# EasyEDA Pro project F405飞控板_2025-11-19.epro

# Schematic F405飞控原理图
Board Name: 飞控板; Create Date: 2024-11-21; Page Name: P1; Project Name: F405空心杯飞控; Schematic Name: F405飞控原理图; Update Date: 2025-05-13; Company: 嘉立创EDA; Page Size: A4; Version: V1.0
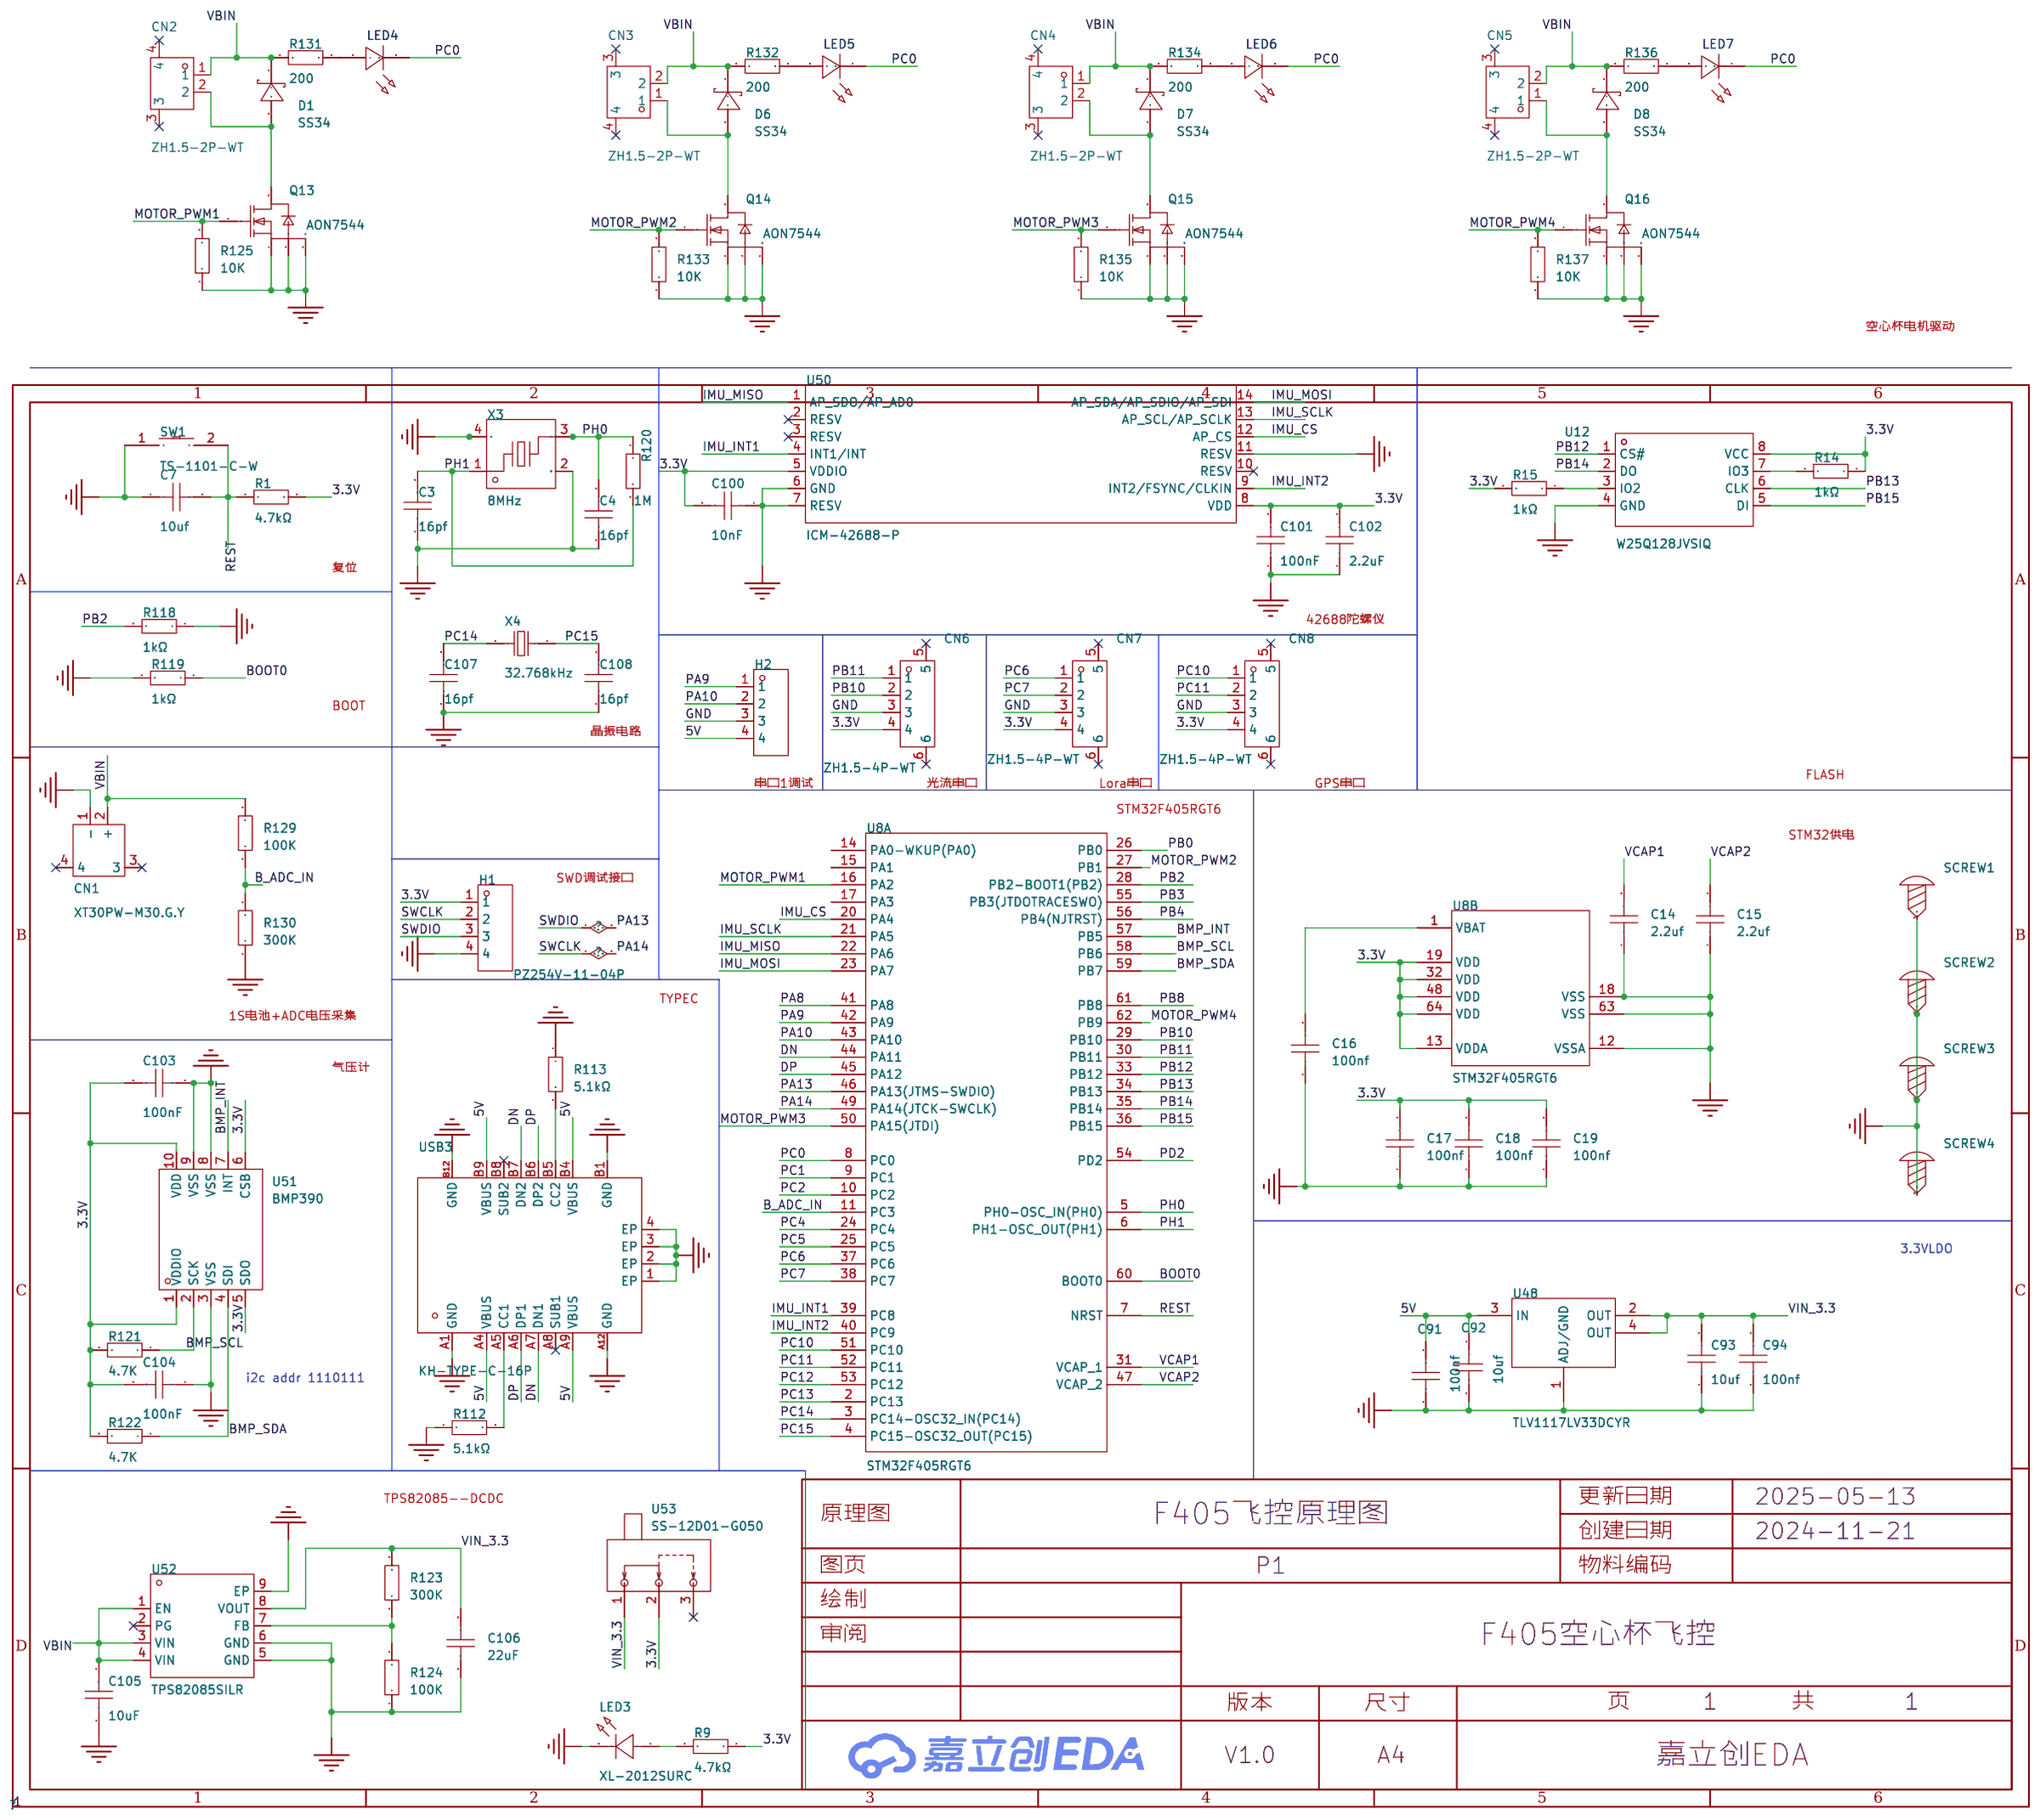
[diagram p0: schematic sheet]

## Parts
C3  16pf  [C0805]
C4  16pf  [C0805]
C7  10uf  [C0805]
C14  2.2uf  [C0603]
C15  2.2uf  [C0603]
C16  100nf  [C0603]
C17  100nf  [C0603]
C18  100nf  [C0603]
C19  100nf  [C0603]
C91  100nf  [C0603]
C92  10uf  [C0805]
C93  10uf  [C0805]
C94  100nf  [C0603]
C100  10nF  [C0603]
C101  100nF  [C0603]
C102  2.2uF  [C0603]
C103  100nF  [C0603]
C104  100nF  [C0603]
C105  10uF  [C0805]
C106  22uF  [C0805]
C107  16pf  [C0805]
C108  16pf  [C0805]
CN1  XT30PW-M30.G.Y  [CONN-TH_XT30PW-M]
CN2  ZH1.5-2P-WT  [CONN-SMD_ZH1.5-2P-WT]
CN3  ZH1.5-2P-WT  [CONN-SMD_ZH1.5-2P-WT]
CN4  ZH1.5-2P-WT  [CONN-SMD_ZH1.5-2P-WT]
CN5  ZH1.5-2P-WT  [CONN-SMD_ZH1.5-2P-WT]
CN6  ZH1.5-4P-WT  [CONN-TH_ZH1.5-4P-WT]
CN7  ZH1.5-4P-WT  [CONN-TH_ZH1.5-4P-WT]
CN8  ZH1.5-4P-WT  [CONN-TH_ZH1.5-4P-WT]
D1  SS34  [SMA_L4.3-W2.6-LS5.2-RD]
D6  SS34  [SMA_L4.3-W2.6-LS5.2-RD]
D7  SS34  [SMA_L4.3-W2.6-LS5.2-RD]
D8  SS34  [SMA_L4.3-W2.6-LS5.2-RD]
H1  PZ254V-11-04P  [HDR-TH_4P-P2.54-V-M]
H2  -  [HDR-TH_4P-P2.54-V-F]
LED3  XL-2012SURC  [LED0805-R-RD]
LED4  -  [LED_0805]
LED5  -  [LED_0805]
LED6  -  [LED_0805]
LED7  -  [LED_0805]
Q13  AON7544  [DFN-8_L3.3-W3.3-P0.65-BL-2]
Q14  AON7544  [DFN-8_L3.3-W3.3-P0.65-BL-2]
Q15  AON7544  [DFN-8_L3.3-W3.3-P0.65-BL-2]
Q16  AON7544  [DFN-8_L3.3-W3.3-P0.65-BL-2]
R1  4.7kΩ  [R0603]
R9  4.7kΩ  [R0603]
R14  1kΩ  [R0603]
R15  1kΩ  [R0603]
R112  5.1kΩ  [R0603]
R113  5.1kΩ  [R0603]
R118  1kΩ  [R0603]
R119  1kΩ  [R0603]
R120  1M  [R0603]
R121  4.7K  [R0603]
R122  4.7K  [R0603]
R123  300K  [R0603]
R124  100K  [R0603]
R125  10K  [R0603]
R129  100K  [R0603]
R130  300K  [R0603]
R131  200  [R0603]
R132  200  [R0603]
R133  10K  [R0603]
R134  200  [R0603]
R135  10K  [R0603]
R136  200  [R0603]
R137  10K  [R0603]
SCREW1  -  [M2螺丝]
SCREW2  -  [M2螺丝]
SCREW3  -  [M2螺丝]
SCREW4  -  [M2螺丝]
SW1  TS-1101-C-W  [SW-SMD_L6.0-W3.3-LS8.0]
U8  STM32F405RGT6  [LQFP-64_L10.0-W10.0-P0.50-LS12.0-BL]  (sections 1,2)
U12  W25Q128JVSIQ  [SOIC-8_L5.3-W5.3-P1.27-LS8.0-BL]
U48  TLV1117LV33DCYR  [SOT-223_L6.7-W3.5-P2.30-BR]
U50  ICM-42688-P  [LGA-14_L3.0-W2.5-P0.50-TL]
U51  BMP390  [LGA-10_L2.0-W2.0-P0.50-BL]
U52  TPS82085SILR  [USIP-8_L3.0-W2.8-P0.65-BL-EP]
U53  SS-12D01-G050  [SW-TH_SS-12D01-GX]
USB3  KH-TYPE-C-16P  [USB-C-SMD_KH-TYPE-C-16P]
X3  8MHz  [CRYSTAL-SMD_4P-L3.2-W2.5-BL]
X4  32.768kHz  [FC-135R_L3.2-W1.5]

## Library data of the parts
C3 C4 C7 C14-C19 C107 C108 = 0805CG221J201NT: LCSC Part Name: 贴片电容; Supplier Part: C20616263; Manufacturer: FH(风华); Supplier Footprint: 0805; JLCPCB Part Class: 扩展库; Datasheet: https://atta.szlcsc.com/upload/public/pdf/source/20230606/6BE0BBCA5E224779106B8DA12BAB40D1.pdf; Supplier: LCSC
C91-C94 = CL21A226MAQNNNE: 容值:22uF;精度:±20%;额定电压:25V;材质(温度系数):X5R;; LCSC Part Name: 22uF ±20% 25V; Supplier Part: C45783; Manufacturer: SAMSUNG(三星); Supplier Footprint: 0805; JLCPCB Part Class: 基础库; Datasheet: https://atta.szlcsc.com/upload/public/pdf/source/20160218/1457707763339.pdf; Supplier: LCSC; Tolerance: ±20%; Voltage Rated: 25V; Temperature Coefficient: X5R
C100-C106 = CAP_0603: Supplier Footprint: 0603
CN1 = XT30PW-M30.G.Y: 类别:-;类型1:-;; LCSC Part Name: AMASS(艾迈斯)航模插头 卧式弯脚 XT30PW-M公头; Supplier Part: C431092; Manufacturer: AMASS(艾迈斯); JLCPCB Part Class: 扩展库; Datasheet: https://atta.szlcsc.com/upload/public/pdf/source/20220222/6A9F22F7850E25B33E1BE430ADF8560B.pdf; Supplier: LCSC; Type: 航模插头; RatedVoltage: DC 500V; InterfaceType: 公头; RatedCurrent: 15A; RecommendedWireGauge: 16/18/20AWG; contact resistance: 1.2mΩ; specifications: 2pin
CN2-CN5 = ZH1.5-2P-WT: 插针结构:1x2P;间距:1.5mm;安装方式:卧贴;参考系列:ZH;总PIN数:2P;排数:1;每排PIN数:2;行距:-;额定电流:1A;工作温度范围:-25℃~+85℃;; LCSC Part Name: 1x2P 间距:1.5mm 卧贴 系列:ZH; Supplier Part: C722913; Manufacturer: CAX(创都); Supplier Footprint: SMD,P=1.5mm,卧贴; JLCPCB Part Class: 扩展库; Datasheet: https://atta.szlcsc.com/upload/public/pdf/source/20200828/C722917_EA5F3D2C7FEC6D00EC455146A7985164.pdf; Supplier: LCSC; Pins Structure: 1x2P; Pitch: 1.5mm; Mounting Style: 卧贴; Reference Series: ZH; Number of Pins: 2P; Number of Rows: 1; Number of PINs Per Row: 2; Current Rating (Max): 1A; Operating Temperature Range: -25℃~+85℃
CN6-CN8 = ZH1.5-4P-WT: 插针结构:1x4P;间距:1.5mm;安装方式:卧贴;参考系列:ZH;总PIN数:4P;排数:1;每排PIN数:4;行距:-;额定电流:1A;工作温度范围:-25℃~+85℃;; LCSC Part Name: 1x4P 间距:1.5mm 卧贴 系列:ZH; Supplier Part: C722921; Manufacturer: CAX(创都); Supplier Footprint: SMD,P=1.5mm,卧贴; JLCPCB Part Class: 扩展库; Datasheet: https://atta.szlcsc.com/upload/public/pdf/source/20200828/C722917_EA5F3D2C7FEC6D00EC455146A7985164.pdf; Supplier: LCSC; Pins Structure: 1x4P; Pitch: 1.5mm; Mounting Style: 卧贴; Reference Series: ZH; Number of Pins: 4P; Number of Rows: 1; Number of PINs Per Row: 4; Current Rating (Max): 1A; Operating Temperature Range: -25℃~+85℃
D1 D6-D8 = SS34_C8678: 二极管配置:独立式;正向压降(Vf):550mV@3A;直流反向耐压(Vr):40V;整流电流:3A;; LCSC Part Name: 电压:40V 电流:3A; Supplier Part: C8678; Manufacturer: MDD(辰达半导体); Supplier Footprint: SMA(DO-214AC); JLCPCB Part Class: 基础库; Datasheet: https://atta.szlcsc.com/upload/public/pdf/source/20240710/2118BB86FDDB2E0B294389AC1F3F65C8.pdf; Supplier: LCSC; Diode Configuration: 独立式; Forward Voltage (Vf@If): 550mV@3A; Reverse Voltage (Vr): 40V; Rectified Current: 3A; Reverse Leakage Current (Ir): 500uA@40V
H1 = PZ254V-11-04P: 插针结构:1x4P;间距:2.54mm;行距:-;圆针/方针:方针;安装类型:直插;排数:单排;总PIN位数:4P;额定电流:3A;额定电压:250V;配合针长度:6mm;塑高:2.5mm;端接针长度:3mm;触头材质:-;工作温度范围:-40℃~+105℃;颜色:黑色;; LCSC Part Name: 间距:2.54mm 1x4P 直插 方针; Supplier Part: C2691448; Manufacturer: XFCN(兴飞); Supplier Footprint: 插件,P=2.54mm; JLCPCB Part Class: 扩展库; Datasheet: https://atta.szlcsc.com/upload/public/pdf/source/20200309/C492403_F9F19131791D08044AD4F84F8E751A34.pdf; Supplier: LCSC; Pin Structure: 1x4P; Pitch: 2.54mm; Circluar Pins/Square Pins: 方针; Mounting Type: 直插; Number of Rows: 单排; Number of Pins: 4P; Current Rating (Max): 3A; Voltage Rating (Max): 250V; Length of Mating Pin: 6mm; Insulation Height: 2.5mm; Length of End Connection Pin: 3mm; Operating Temperature Range: -40℃~+105℃; Color: 黑色
H2 = HDR-F_2.54_1x4P: Supplier Part: C2718488; Supplier Footprint: 插件
LED3 = XL-2012SURC: 发光颜色:红色;功率:55mW;正向电流:25mA;主波长:617nm~621nm;透镜颜色:无色透明透镜;色温:-;发光角度:120°;载带方式:正贴;工作温度:-30℃~+85℃;; Supplier Part: C965812; Manufacturer: XINGLIGHT(成兴光); Supplier Footprint: 0805; JLCPCB Part Class: 扩展库; Datasheet: https://atta.szlcsc.com/upload/public/pdf/source/20221102/49E1A0A365644091E6270AF1C5E0FE37.pdf; Supplier: LCSC; Emitted Color: 红色; Power Dissipation: 55mW; Forward Current: 25mA; Dominant Wavelength: 617nm~621nm; Peak Wavelength: 623nm; Lens Color: 无色透明透镜; Viewing Angle: 120°; Mounting Sytle: 正贴; Operating Temperature: -30℃~+85℃
LED4-LED7 = LED_0805-B: Supplier Footprint: 0805
Q13-Q16 = AON7544: 类型:1个N沟道;漏源电压(Vdss):30V;连续漏极电流(Id):30A;导通电阻(RDS(on)@Vgs,Id):8.5mΩ@4.5V,20A;功率(Pd):3W;阈值电压(Vgs(th)@Id):1.2V@250uA;; LCSC Part Name: 1个N沟道 耐压:30V 电流:30A; Supplier Part: C315567; Manufacturer: AOS; Supplier Footprint: DFN-8(3x3); JLCPCB Part Class: 扩展库; Datasheet: https://atta.szlcsc.com/upload/public/pdf/source/20190614/C315567_E434D67BCCEB23ABC813CC1BF26EA614.pdf; Supplier: LCSC; Type: 1个N沟道; Drain Source Voltage (Vdss): 30V; Continuous Drain Current (Id): 30A; Drain Source On Resistance (RDS(on)@Vgs,Id): 8.5mΩ@4.5V,20A; Power Dissipation (Pd): 3W; Gate Threshold Voltage (Vgs(th)@Id): 1.2V@250uA; Total Gate Charge (Qg@Vgs): 22.5nC@10V; Input Capacitance (Ciss@Vds): 951pF; Reverse Transfer Capacitance (Crss@Vds): 157pF; Operating Temperature: -55℃~+150℃
R1 R9 R14 R15 R118 R119 = 0805W8F4701T5E: 电阻类型:厚膜电阻;阻值:4.7kΩ;精度:±1%;功率:125mW;最大工作电压:150V;温度系数:±100ppm/℃;; LCSC Part Name: 4.7kΩ ±1% 125mW 厚膜电阻; Supplier Part: C17673; Manufacturer: UNI-ROYAL(厚声); Supplier Footprint: 0805; JLCPCB Part Class: 基础库; Datasheet: https://atta.szlcsc.com/upload/public/pdf/source/20200306/C422600_1E6D84923E4A46A82E41ADD87F860B5C.pdf; Supplier: LCSC; Type: 厚膜电阻; Tolerance: ±1%; Power(Watts): 125mW; Overload Voltage (Max): 150V; Temperature Coefficient: ±100ppm/℃; Operating Temperature Range: -55℃~+155℃
R112 R113 = 0805W8F1002T5E_C17414: 电阻类型:厚膜电阻;阻值:10kΩ;精度:±1%;功率:125mW;最大工作电压:150V;温度系数:±100ppm/℃;; LCSC Part Name: 10kΩ ±1% 125mW 厚膜电阻; Supplier Part: C17513; Manufacturer: UNI-ROYAL(厚声); Manufacturer Part: 0805W8F1002T5E; Supplier Footprint: 0805; JLCPCB Part Class: 基础库; Datasheet: https://atta.szlcsc.com/upload/public/pdf/source/20200306/C422600_1E6D84923E4A46A82E41ADD87F860B5C.pdf; Supplier: LCSC; Type: 厚膜电阻; Tolerance: ±1%; Power(Watts): 125mW; Overload Voltage (Max): 150V; Temperature Coefficient: ±100ppm/℃; Operating Temperature Range: -55℃~+155℃
R120-R122 R125 R129-R137 = Res_0603: Supplier Footprint: 0603
R123 R124 = Res_0805: Supplier Footprint: 0805
SCREW1-SCREW4 = M2螺丝: Supplier Footprint: 插件
SW1 = TS-1101-C-W: 电路结构:单刀单掷;按钮形状:矩形按钮;作用力:260gf;安装方式:立贴;开关长度:6mm;开关宽度:3.6mm;开关高度:2.5mm;带支架:不带;触点电流:50mA;额定电压(AC):-;额定电压(DC):12V;额定功率:-;绝缘电阻:-;带灯:无;机械寿命:5万次;; LCSC Part Name: 6*3.6*2.5mm 立贴 轻触开关; Supplier Part: C318938; Manufacturer: XKB Connectivity(中国星坤); Supplier Footprint: SMD; JLCPCB Part Class: 扩展库; Datasheet: https://atta.szlcsc.com/upload/public/pdf/source/20200227/C318938_C2E53B1EEDE37D980A33616AC086DE53.pdf; Supplier: LCSC; Circuit: 单刀单掷; Actuator Style: 矩形按钮; Operating Force: 260gf; Mounting Style: 立贴; Switch Length: 6mm; Switch Width: 3.6mm; Switch Height: 2.5mm; Strike Gundam: 不带; Contact Current: 50mA; Voltage Rating (DC): 12V; Actuator/Cap Color: 白色带淡绿; With Lamp: 无; Mechanical Life: 5万次; Operating Temperature: -30℃~+85℃
U8 = STM32F405RGT6: CPU内核:ARM-M4;程序存储容量:1MB;RAM总容量:192KB;GPIO端口数量:51;工作电压范围:1.8V~3.6V;CPU最大主频:168MHz;程序存储器类型:FLASH;; LCSC Part Name: 带DSP和FPU的高性能基础系列ARM Cortex-M4 MCU，具有1 MB Flash、168 MHz CPU和ART加速器; Supplier Part: C15742; Manufacturer: ST(意法半导体); Supplier Footprint: LQFP-64(10x10); JLCPCB Part Class: 扩展库; Datasheet: https://atta.szlcsc.com/upload/public/pdf/source/20140801/1457707197138.pdf; Supplier: LCSC; CPU Core: ARM-M4; Program Storage Size: 1MB; RAM Size: 192KB; GPIO Ports Number: 51; Operating Voltage Range: 1.8V~3.6V; CPU Maximum Speed: 168MHz; Program Memory Type: FLASH; Operating Temperature Range: -40℃~+85℃; ADC (Bit): 12bit; DAC (Bit): 12bit; Universal Serial Bus: 有; Peripheral/Function: DMA；LCD/LED驱动；PWM; Watchdog: 有; Infrared Data Association: 有; Low-Voltage Detect: 有; LCD Module: 有; Direct Memory Access: 有; Internal Oscillator: 有
U12 = W25Q128JVSIQ: 接口类型:-;存储容量:128Mbit;时钟频率(fc):-;; LCSC Part Name: W25Q128JVSIQ 编带; Supplier Part: C97521; Manufacturer: WINBOND(华邦); Supplier Footprint: SOIC-8-208mil; JLCPCB Part Class: 基础库; Datasheet: https://atta.szlcsc.com/upload/public/pdf/source/20170316/1489627409956.pdf; Supplier: LCSC; Memory Size: 128Mbit
U48 = TLV1117LV33DCYR: 输出类型:固定;最大输入电压:5.5V;输出电压:3.3V;输出电流:1A;电源纹波抑制比(PSRR):75dB@(120Hz);输出极性:正极;; LCSC Part Name: 1A 低压降稳压器; Supplier Part: C15578; Manufacturer: TI(德州仪器); Supplier Footprint: SOT-223; JLCPCB Part Class: 扩展库; Datasheet: https://www.ti.com/cn/lit/gpn/tlv1117lv; Supplier: LCSC; Output Type: 固定; Maximum Input Voltage: 5.5V; Output Voltage: 3.3V; Output Current: 1A; Power Supply Rejection Ratio (PSRR): 75dB@(120Hz); Dropout Voltage: 1.3V@(800mA); standby current: 100uA; Feature: 防静电保护；低ESR；热保护(TSD)；欠压闭锁；过流保护(OCP)；带使能; Operating Temperature: -40℃~+125℃; Output Polarity: 正极; Number of Outputs: 1
U50 = ICM-42688-P: 传感器类型:加速度计陀螺仪;; Supplier Part: C1850418; Manufacturer: TDK InvenSense(应美盛); Supplier Footprint: LGA-14(2.5x3); JLCPCB Part Class: 扩展库; Datasheet: https://atta.szlcsc.com/upload/public/pdf/source/20210703/CF24204867ACE5B754A2B035F23E5931.pdf; Supplier: LCSC; Sensor Type: 加速度计陀螺仪
U51 = BMP390_C5124834: 压力范围:30Kpa~125Kpa;; Supplier Part: C5124834; Manufacturer: Bosch(博世); Supplier Footprint: LGA-10(2x2); JLCPCB Part Class: 扩展库; Datasheet: https://atta.szlcsc.com/upload/public/pdf/source/20221222/1C81EE3357D96DEF74970C4DA2251172.pdf; Supplier: LCSC; Pressure range: 30Kpa~125Kpa; The Power Supply Voltage: 1.65V~3.6V; Operating Temperature: -40℃~+85℃
U52 = TPS82085SILR: TPS82085 集成感应器的 3A 降压转换器（截面 &lt; 1.3mm）; Supplier Part: C465728; Manufacturer: TI(德州仪器); Supplier Footprint: USIP-8; JLCPCB Part Class: 扩展库; Datasheet: https://www.ti.com/cn/lit/gpn/tps82085; Supplier: LCSC
U53 = SS-12D01-G050: 1P2T直柄拨动开关；柄长5.0mm；行程2.0mm；单排两档拨动; LCSC Part Name: 拨动开关SS-12D01 柄高5mm; Supplier Part: C5446805; Manufacturer: G-Switch(品赞); Supplier Footprint: 插件; JLCPCB Part Class: 扩展库; Datasheet: https://atta.szlcsc.com/upload/public/pdf/source/20230412/820259B1122C3B165ABC23F7C0C2BED1.pdf; Supplier: LCSC
USB3 = KH-TYPE-C-16P: 连接器类型:Type-C;标准:-;公母:母;端口数量:1;触点数量:16P;安装方式:卧贴;额定电流 - 电源:3A;工作温度范围:-40℃~+85℃;; LCSC Part Name: Type-C 母 卧贴; Supplier Part: C709357; Manufacturer: kinghelm(金航标); Supplier Footprint: SMD; JLCPCB Part Class: 扩展库; Datasheet: https://atta.szlcsc.com/upload/public/pdf/source/20200911/C709357_AA8DCEB38BB20E3035A7ED7AE7667837.pdf; Supplier: LCSC; Connector Type: Type-C; Gender: 母; Number of Ports: 1; Number of Contacts: 16P; Mounting Style: 卧贴; Current Rating - Power (Max): 3A; Operating Temperature Range: -40℃~+85℃
X3 = X32258MSB4SI: 晶振类型:贴片晶振;频率:8MHz;常温频差:±10ppm;外接负载电容:20pF;频率稳定度(全温):±20ppm;; LCSC Part Name: 8MHz ±10ppm 20pF; Supplier Part: C2682774; Manufacturer: YXC(扬兴晶振); Supplier Footprint: SMD3225-4P; JLCPCB Part Class: 扩展库; Datasheet: https://atta.szlcsc.com/upload/public/pdf/source/20240329/19D5F850207469550BEB00D7DFEDBC7A.pdf; Supplier: LCSC; Crystal Type: 贴片晶振; Normal temperature Frequency Tolerance: ±10ppm; External load capacitor: 20pF; Frequency Stability(Full temperature range): ±20ppm; Operating Temperature: -40℃~+85℃
X4 = Q13FC13500004_C32346: 晶振类型:贴片晶振;频率:32.768kHz;常温频差:±20ppm;负载电容:12.5pF;; LCSC Part Name: 32.768kHz ±20ppm 12.5pF; Supplier Part: C32346; Manufacturer: EPSON(爱普生); Manufacturer Part: Q13FC13500004; Supplier Footprint: SMD3215-2P; JLCPCB Part Class: 基础库; Datasheet: https://atta.szlcsc.com/upload/public/pdf/source/20240418/0E0FF5F0356BA3753F616001439D1416.pdf; Supplier: LCSC; Crystal Type: 贴片晶振; Normal temperature Frequency Tolerance: ±20ppm; Load Capacitor: 12.5pF; Equivalent Series Resistance (ESR): 70kΩ; Operating Temperature: -40℃~+85℃

## Nets
3.3V: C17.2 C18.2 C19.2 C100.2 C101.2 C102.2 C103.2 C104.2 CN6.4 CN7.4 CN8.4 H1.1 R1.2 R9.1 R14.1 R15.2 R121.2 R122.2 U8.13(VDDA) U8.19(VDD) U8.32(VDD) U8.48(VDD) U8.64(VDD) U12.8(VCC) U50.5(VDDIO) U50.8(VDD) U51.1(VDDIO) U51.5(SDO) U51.6(CSB) U51.10(VDD) U53.2
5V: C91.2 C92.1 H2.4 U48.3(IN) USB3.A4(VBUS) USB3.A9(VBUS) USB3.B4(VBUS) USB3.B9(VBUS)
GND: C3.1 C4.1 C7.1 C14.1 C15.1 C16.1 C17.1 C18.1 C19.1 C91.1 C92.2 C93.1 C94.1 C100.1 C101.1 C102.1 C103.1 C104.1 C105.1 C106.1 C107.1 C108.1 CN1.1(-) CN6.3 CN7.3 CN8.3 H1.4 H2.3 LED3.2(K) Q13.1(S) Q13.2(S) Q13.3(S) Q14.1(S) Q14.2(S) Q14.3(S) Q15.1(S) Q15.2(S) Q15.3(S) Q16.1(S) Q16.2(S) Q16.3(S) R112.1 R113.1 R118.1 R119.2 R124.1 R125.1 R130.1 R133.1 R135.1 R137.1 SCREW1.1 SCREW2.1 SCREW3.1 SCREW4.1 SW1.1 U8.12(VSSA) U8.18(VSS) U8.63(VSS) U12.4(GND) U48.1(ADJ/GND) U50.6(GND) U50.7(RESV) U50.11(RESV) U51.3(VSS) U51.8(VSS) U51.9(VSS) U52.5(GND) U52.6(GND) U52.9(EP) USB3.1(EP) USB3.2(EP) USB3.3(EP) USB3.4(EP) USB3.A1(GND) USB3.A12(GND) USB3.B1(GND) USB3.B12(GND) X3.2(GND) X3.4(GND)
VIN_3.3: C93.2 C94.2 C106.2 R123.2 U48.2(OUT) U48.4(OUT) U52.8(VOUT) U53.1
B_ADC_IN: R129.1 R130.2 U8.11(PC3)
BMP_INT: U8.57(PB5) U51.7(INT)
BMP_SCL: R121.1 U8.58(PB6) U51.2(SCK)
BMP_SDA: R122.1 U8.59(PB7) U51.4(SDI)
BOOT0: R119.1 U8.60(BOOT0)
DN: U8.44(PA11) USB3.A7(DN1) USB3.B7(DN2)
DP: U8.45(PA12) USB3.A6(DP1) USB3.B6(DP2)
IMU_CS: U8.20(PA4) U50.12(AP_CS)
IMU_INT1: U8.39(PC8) U50.4(INT1/INT)
IMU_INT2: U8.40(PC9) U50.9(INT2/FSYNC/CLKIN)
IMU_MISO: U8.22(PA6) U50.1(AP_SDO/AP_AD0)
IMU_MOSI: U8.23(PA7) U50.14(AP_SDA/AP_SDIO/AP_SDI)
IMU_SCLK: U8.21(PA5) U50.13(AP_SCL/AP_SCLK)
MOTOR_PWM1: Q13.4(G) R125.2 U8.16(PA2)
MOTOR_PWM2: Q14.4(G) R133.2 U8.27(PB1)
MOTOR_PWM3: Q15.4(G) R135.2 U8.50(PA15(JTDI))
MOTOR_PWM4: Q16.4(G) R137.2 U8.62(PB9)
PA8: U8.41(PA8)
PA9: H2.1 U8.42(PA9)
PA10: H2.2 U8.43(PA10)
PA13: H1.3 U8.46(PA13(JTMS-SWDIO))
PA14: H1.2 U8.49(PA14(JTCK-SWCLK))
PB0: U8.26(PB0)
PB2: R118.2 U8.28(PB2-BOOT1(PB2))
PB3: U8.55(PB3(JTDOTRACESWO))
PB4: U8.56(PB4(NJTRST))
PB8: U8.61(PB8)
PB10: CN6.2 U8.29(PB10)
PB11: CN6.1 U8.30(PB11)
PB12: U8.33(PB12) U12.1(CS#)
PB13: U8.34(PB13) U12.6(CLK)
PB14: U8.35(PB14) U12.2(DO)
PB15: U8.36(PB15) U12.5(DI)
PC0: LED4.1(C) LED5.1(C) LED6.1(C) LED7.1(C) U8.8(PC0)
PC1: U8.9(PC1)
PC2: U8.10(PC2)
PC4: U8.24(PC4)
PC5: U8.25(PC5)
PC6: CN7.1 U8.37(PC6)
PC7: CN7.2 U8.38(PC7)
PC10: CN8.1 U8.51(PC10)
PC11: CN8.2 U8.52(PC11)
PC12: U8.53(PC12)
PC13: U8.2(PC13)
PC14: C107.2 U8.3(PC14-OSC32_IN(PC14)) X4.1
PC15: C108.2 U8.4(PC15-OSC32_OUT(PC15)) X4.2
PD2: U8.54(PD2)
PH0: C4.2 R120.1 U8.5(PH0-OSC_IN(PH0)) X3.3
PH1: C3.2 R120.2 U8.6(PH1-OSC_OUT(PH1)) X3.1
REST: C7.2 R1.1 SW1.2 U8.7(NRST)
VBIN: C105.2 CN1.2(+) CN2.1 CN3.2 CN4.1 CN5.2 D1.1(K) D6.1(K) D7.1(K) D8.1(K) R129.2 R131.2 R132.2 R134.2 R136.2 U52.1(EN) U52.3(VIN) U52.4(VIN)
VCAP1: C14.2 U8.31(VCAP_1)
VCAP2: C15.2 U8.47(VCAP_2)
$3N2923: C16.2 U8.1(VBAT)
$3N3608: LED3.1(A) R9.2
$3N6562: R14.2 U12.7(IO3)
$3N6651: R15.1 U12.3(IO2)
$3N7026: R113.2 USB3.B5(CC2)
$3N20479: R112.2 USB3.A5(CC1)
$3N28799: R123.1 R124.2 U52.7(FB)
$3N34432: LED4.2(A) R131.1
$3N39293: CN2.2 D1.2(A) Q13.5(D)
$3N40714: LED5.2(A) R132.1
$3N40717: CN3.1 D6.2(A) Q14.5(D)
$3N40954: LED6.2(A) R134.1
$3N40957: CN4.2 D7.2(A) Q15.5(D)
$3N41194: LED7.2(A) R136.1
$3N41197: CN5.1 D8.2(A) Q16.5(D)

Not connected (* = marked no-connect by the designer): CN1 3* 4*; CN2 3* 4*; CN3 3* 4*; CN4 3* 4*; CN5 3* 4*; CN6 5* 6*; CN7 5* 6*; CN8 5* 6*; U8 14(PA0-WKUP(PA0)) 15(PA1) 17(PA3); U50 2(RESV)* 3(RESV)* 10(RESV)*; U52 2(PG)*; U53 3*; USB3 A8(SUB1)* B8(SUB2)*

## Notes on the sheet
- 空心杯电机驱动
- 复位
- 42688陀螺仪
- BOOT
- 晶振电路
- FLASH
- 串口1调试
- 光流串口
- Lora串口
- GPS串口
- STM32F405RGT6
- STM32供电
- SWD调试接口
- TYPEC
- 1S电池+ADC电压采集
- 气压计
- 3.3VLDO
- i2c addr 1110111
- TPS82085--DCDC

# Board PCB1
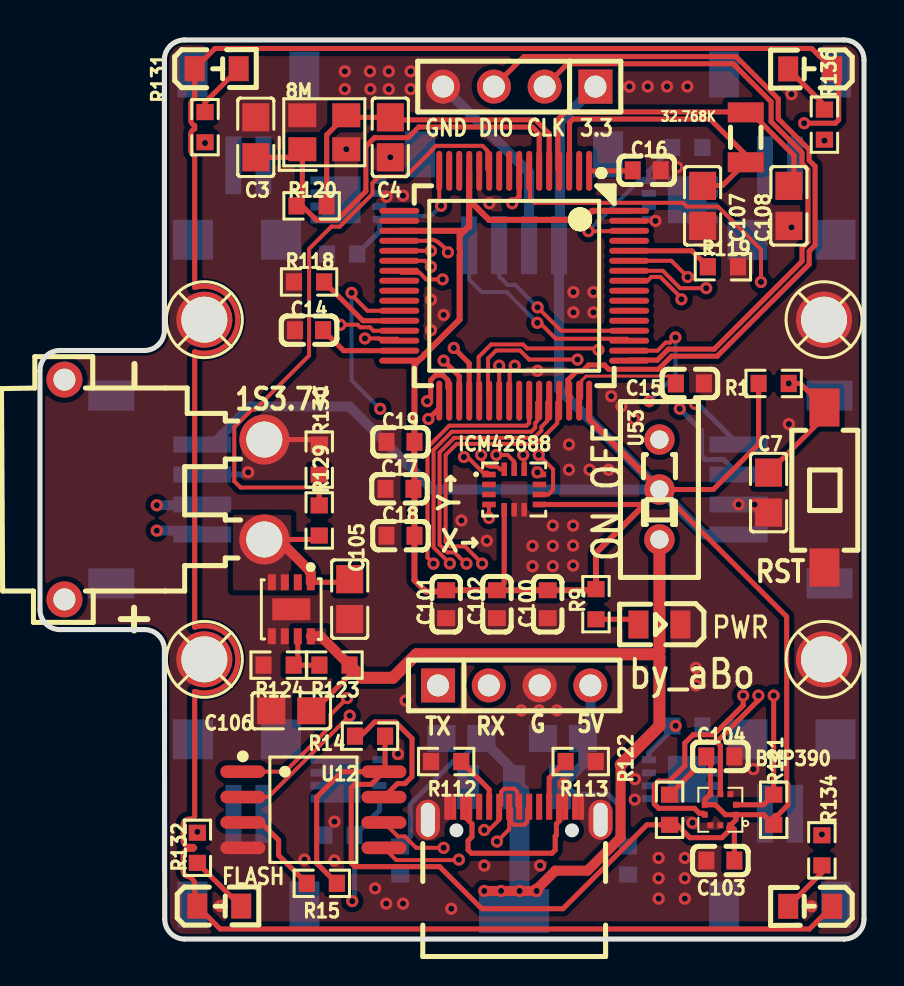
[diagram p1: board, top side]
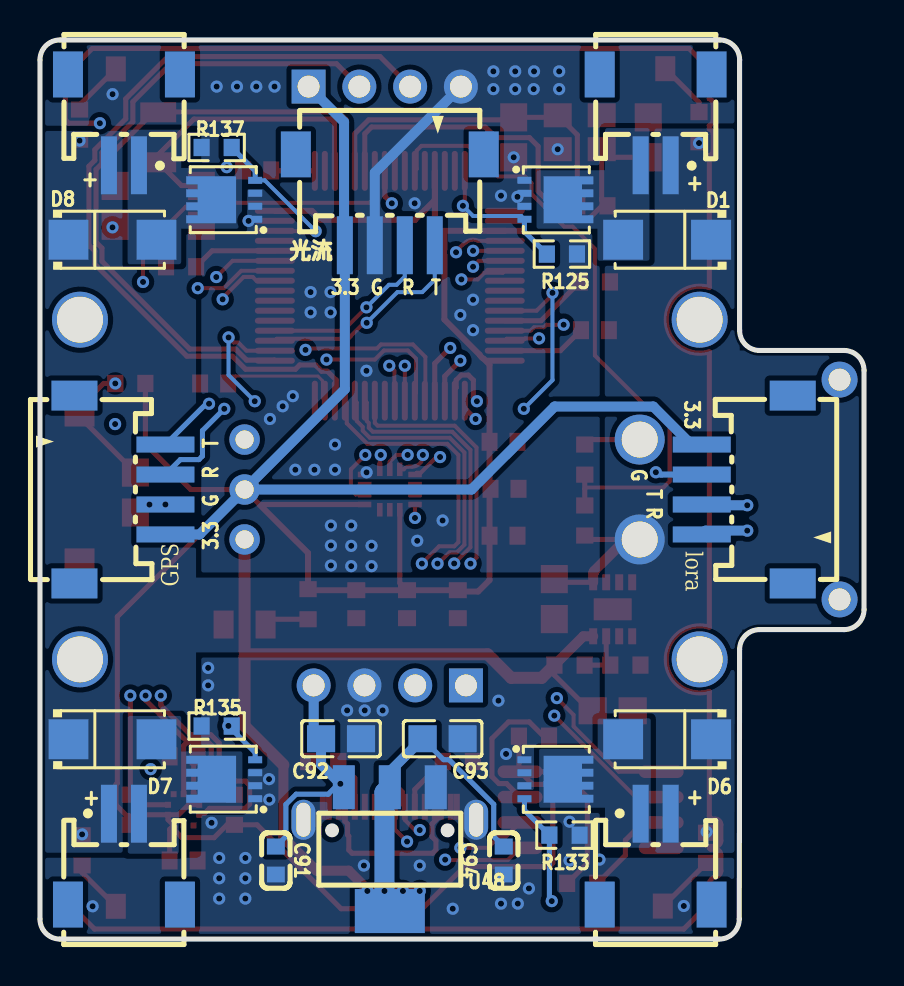
[diagram p2: board, bottom side, seen from below]

Outline 41.22 x 45 mm; copper layers: Top Layer, Inner1, Inner2, Bottom Layer. Coordinates in mm from the lower left corner of the outline.
Outline path: 0,28.46 0,16.49 arc(0.29,15.78) 1,15.49 5.22,15.49 arc(5.93,15.2) 6.22,14.49 6.24,1 arc(6.53,0.29) 7.24,0 40.22,0 arc(40.93,0.29) 41.22,1 41.22,44 arc(40.93,44.71) 40.22,45 7.22,45 arc(6.52,44.71) 6.22,44 6.22,30.46 arc(5.93,29.75) 5.22,29.46 1,29.46 arc(0.29,29.17) 0,28.46
Stack: Top Layer 0.035mm 外层铜厚1oz / Dielectric1 0.2104mm 7628 RC49% 8.6mil / Inner1 0.0152mm 内层铜厚 / Dielectric2 1.065mm 1.1mm H/HOZ Copper / Inner2 0.0152mm 内层铜厚 / Dielectric3 0.2104mm 7628 RC49% 8.6mil / Bottom Layer 0.035mm 外层铜厚1oz

## Design rules (mm)
template: 自定义配置
spacing copperThickness1oz (default): track to track 0.102, other pairs 0.152 to 0.3
spacing copperThickness2oz: track to track 0.203, other pairs 0.152 to 0.3
spacing copperThicknessInner0.5oz: track to track 0.089, other pairs 0.152 to 0.3
track width copperThickness1oz (default): min 0.102, default 0.254, max 4
track width copperThickness2oz: min 0.203, default 0.254, max 2.54
track width copperThickness0.5oz: min 0.089, default 0.254, max 2.54
differential pair differentialPair (default): width min 0.127, default 0.254, max 2.54; gap min 0.152, default 0.152
via viaSize (default): diameter min 0.3, default 0.61, max 10; hole min 0.2, default 0.305, max 6.3
net GND uses copperRegion1, innerPlane1
net 5V uses copperRegion1
net VIN_3.3 uses copperRegion1
net VBIN uses copperRegion1
net $3N39293 uses copperRegion1
net $3N40717 uses copperRegion1
net $3N41197 uses copperRegion1
pour e166 uses copperRegion1

## Placement (name value [footprint] x y rotation side)
8M  8MHz  [CRYSTAL-SMD_4P-L3.2-W2.5-BL]  14.22 40.38 0 top
32.768K  32.768kHz  [FC-135R_L3.2-W1.5]  35.31 40.13 90 top
BMP390  BMP390  [LGA-10_L2.0-W2.0-P0.50-BL]  34.04 6.47 90 top
C3  16pf  [C0805]  10.8 40.13 270 top
C4  16pf  [C0805]  17.53 40.13 90 top
C7  10uf  [C0805]  36.45 22.35 90 top
C14  2.2uf  [C0603]  13.46 30.47 0 top
C15  2.2uf  [C0603]  32.51 27.81 180 top
C16  100nf  [C0603]  30.35 38.48 180 top
C17  100nf  [C0603]  17.98 22.54 0 top
C18  100nf  [C0603]  18.03 20.19 0 top
C19  100nf  [C0603]  18.03 24.89 0 top
C91  100nf  [C0603]  29.42 3.93 90 bottom
C92  10uf  [C0805]  26.16 10.03 180 bottom
C93  10uf  [C0805]  21.08 10.03 0 bottom
C94  100nf  [C0603]  18.02 3.93 90 bottom
C100  10nF  [C0603]  25.4 16.76 90 top
C101  100nF  [C0603]  20.32 16.76 90 top
C102  2.2uF  [C0603]  22.86 16.76 90 top
C103  100nF  [C0603]  34.04 3.93 0 top
C104  100nF  [C0603]  34.04 9.14 180 top
C105  10uF  [C0805]  15.49 17.01 90 top
C106  22uF  [C0805]  12.57 11.42 0 top
C107  16pf  [C0805]  33.15 36.7 90 top
C108  16pf  [C0805]  37.46 36.7 90 top
CN1  XT30PW-M30.G.Y  [CONN-TH_XT30PW-M]  6.22 22.5 270 top
CN2  ZH1.5-2P-WT  [CONN-SMD_ZH1.5-2P-WT]  10.42 41 0 bottom
CN3  ZH1.5-2P-WT  [CONN-SMD_ZH1.5-2P-WT]  10.42 4 180 bottom
CN4  ZH1.5-2P-WT  [CONN-SMD_ZH1.5-2P-WT]  37.02 4 180 bottom
CN5  ZH1.5-2P-WT  [CONN-SMD_ZH1.5-2P-WT]  37.02 41 0 bottom
CN6  ZH1.5-4P-WT  [CONN-TH_ZH1.5-4P-WT]  5.84 22.5 90 bottom
CN7  ZH1.5-4P-WT  [CONN-TH_ZH1.5-4P-WT]  37.22 22.5 270 bottom
CN8  ZH1.5-4P-WT  [CONN-TH_ZH1.5-4P-WT]  23.72 37 0 bottom
D1  SS34  [SMA_L4.3-W2.6-LS5.2-RD]  9.85 35 0 bottom
D6  SS34  [SMA_L4.3-W2.6-LS5.2-RD]  9.85 10 0 bottom
D7  SS34  [SMA_L4.3-W2.6-LS5.2-RD]  37.6 10 180 bottom
D8  SS34  [SMA_L4.3-W2.6-LS5.2-RD]  37.6 35 180 bottom
H1  PZ254V-11-04P  [HDR-TH_4P-P2.54-V-M]  23.98 42.67 180 top
H2  -  [HDR-TH_4P-P2.54-V-F]  23.72 12.69 0 top
ICM42688  ICM-42688-P  [LGA-14_L3.0-W2.5-P0.50-TL]  23.72 22.5 0 top
LED3  XL-2012SURC  [LED0805-R-RD]  30.99 15.74 180 top
LED4  -  [LED_0805]  8.89 43.56 0 top
LED5  -  [LED_0805]  9.02 1.65 0 top
LED6  -  [LED_0805]  38.48 1.65 180 top
LED7  -  [LED_0805]  38.48 43.56 180 top
Q13  AON7544  [DFN-8_L3.3-W3.3-P0.65-BL-2]  16.22 37 270 bottom
Q14  AON7544  [DFN-8_L3.3-W3.3-P0.65-BL-2]  16.22 8 270 bottom
Q15  AON7544  [DFN-8_L3.3-W3.3-P0.65-BL-2]  31.22 8 90 bottom
Q16  AON7544  [DFN-8_L3.3-W3.3-P0.65-BL-2]  31.22 37 90 bottom
R1  4.7kΩ  [R0603]  36.7 27.81 180 top
R9  4.7kΩ  [R0603]  27.81 16.76 270 top
R14  1kΩ  [R0603]  16.51 10.16 180 top
R15  1kΩ  [R0603]  14.1 2.79 0 top
R112  5.1kΩ  [R0603]  20.32 8.89 0 top
R113  5.1kΩ  [R0603]  27.05 8.89 180 top
R118  1kΩ  [R0603]  13.46 32.89 0 top
R119  1kΩ  [R0603]  34.16 33.65 0 top
R120  1M  [R0603]  13.59 36.7 180 top
R121  4.7K  [R0603]  36.7 6.47 270 top
R122  4.7K  [R0603]  31.5 6.47 270 top
R123  300K  [R0603]  14.73 13.71 0 top
R124  100K  [R0603]  11.94 13.71 0 top
R125  10K  [R0603]  15.11 34.28 0 bottom
R129  100K  [R0603]  13.97 20.95 270 top
R130  300K  [R0603]  13.97 24 270 top
R131  200  [R0603]  8.26 40.64 270 top
R132  200  [R0603]  7.87 4.57 90 top
R133  10K  [R0603]  14.99 5.2 0 bottom
R134  200  [R0603]  39.12 4.44 90 top
R135  10K  [R0603]  32.39 10.66 180 bottom
R136  200  [R0603]  39.24 40.76 270 top
R137  10K  [R0603]  32.39 39.62 180 bottom
SCREW1  -  [M2螺丝]  8.22 31 0 top
SCREW2  -  [M2螺丝]  39.22 31 0 top
SCREW3  -  [M2螺丝]  8.22 14 0 top
SCREW4  -  [M2螺丝]  39.22 14 0 top
SW1  TS-1101-C-W  [SW-SMD_L6.0-W3.3-LS8.0]  39.24 22.6 90 top
U8  STM32F405RGT6  [LQFP-64_L10.0-W10.0-P0.50-LS12.0-BL]  23.72 32.7 180 top
U12  W25Q128JVSIQ  [SOIC-8_L5.3-W5.3-P1.27-LS8.0-BL]  13.68 6.47 270 top
U48  TLV1117LV33DCYR  [SOT-223_L6.7-W3.5-P2.30-BR]  23.72 4.5 90 bottom
U52  TPS82085SILR  [USIP-8_L3.0-W2.8-P0.65-BL-EP]  12.57 16.5 90 top
U53  SS-12D01-G050  [SW-TH_SS-12D01-GX]  30.99 22.5 90 top
USB3  KH-TYPE-C-16P  [USB-C-SMD_KH-TYPE-C-16P]  23.72 4.21 0 top

## Footprints (pads in the part's own frame, mm; a bottom-side part is the same pattern mirrored in y, then rotated)
C0603
  rect 0.8x0.9 smd: 1(-0.7,0) 2(0.7,0)
C0805
  rect 1.41x1.35 smd: 1(-1,0) 2(1,0)
CONN-SMD_ZH1.5-2P-WT
  rect 0.8x2.9 smd: 1(-0.75,2.275) 2(0.75,2.275)
  rect 1.5x2.3 smd: 3(-2.8,-2.275) 4(2.8,-2.275)
CONN-TH_XT30PW-M
  round 2.5 hole 1.8: 1(-2.5,5) 2(2.5,5)
  round 1.8 hole 1.1: 3(5.5,-5) 4(-5.5,-5)
CONN-TH_ZH1.5-4P-WT
  rect 0.8x2.9 smd: 1(-2.25,2.275) 2(-0.75,2.275) 3(0.75,2.275) 4(2.25,2.275)
  rect 1.5x2.3 smd: 5(4.7,-2.275) 6(-4.7,-2.275)
CRYSTAL-SMD_4P-L3.2-W2.5-BL
  rect 1.4x1.2 smd: 1(-1.1,-0.85) 2(1.1,-0.85) 3(1.1,0.85) 4(-1.1,0.85)
DFN-8_L3.3-W3.3-P0.65-BL-2
  rect 0.35x0.7 smd: 1(-0.975,-0.765) 2(-0.325,-0.765) 3(0.325,-0.765) 4(0.975,-0.765)
  custom 2.352x2.498 smd: 5(0,0.765)
FC-135R_L3.2-W1.5
  rect 1x1.8 smd: 1(-1.25,0) 2(1.25,0)
HDR-TH_4P-P2.54-V-F
  rect 1.7x1.7 hole 1.1: 1(-3.81,0)
  round 1.7 hole 1.1: 2(-1.27,0) 3(1.27,0) 4(3.81,0)
HDR-TH_4P-P2.54-V-M
  rect 1.7x1.7 hole 1.1: 1(-3.81,0)
  round 1.7 hole 1.1: 2(-1.27,0) 3(1.27,0) 4(3.81,0)
LED0805-R-RD
  rect 1x1.399 smd: 1(1.05,0) 2(-1.05,0)
LED_0805
  rect 1x1.25 smd: 1(-1.15,0.005) 2(1.05,0.005)
LGA-10_L2.0-W2.0-P0.50-BL
  rect 0.3x0.3 smd: 1(-0.25,-0.78) 2(0.25,-0.78) 3(0.78,-0.5) 4(0.78,0) 5(0.78,0.5) 6(0.25,0.78) 7(-0.25,0.78) 8(-0.78,0.5) 9(-0.78,0) 10(-0.78,-0.5)
LGA-14_L3.0-W2.5-P0.50-TL
  rect 0.675x0.28 smd: 1(-1.262,0.75) 2(-1.262,0.25) 3(-1.262,-0.25) 4(-1.262,-0.75) 8(1.262,-0.75) 9(1.262,-0.25) 10(1.262,0.25) 11(1.262,0.75)
  rect 0.28x0.675 smd: 5(-0.5,-1.012) 6(0,-1.012) 7(0.5,-1.012) 12(0.5,1.012) 13(0,1.012) 14(-0.5,1.012)
LQFP-64_L10.0-W10.0-P0.50-LS12.0-BL
  oval 0.3x2 smd: 1(-3.75,-5.75) 2(-3.25,-5.75) 3(-2.75,-5.75) 4(-2.25,-5.75) 5(-1.75,-5.75) 6(-1.25,-5.75) 7(-0.75,-5.75) 8(-0.25,-5.75) 9(0.25,-5.75) 10(0.75,-5.75) 11(1.25,-5.75) 12(1.75,-5.75) 13(2.25,-5.75) 14(2.75,-5.75) 15(3.25,-5.75) 16(3.75,-5.75) 33(3.75,5.75) 34(3.25,5.75) 35(2.75,5.75) 36(2.25,5.75) 37(1.75,5.75) 38(1.25,5.75) 39(0.75,5.75) 40(0.25,5.75) 41(-0.25,5.75) 42(-0.75,5.75) 43(-1.25,5.75) 44(-1.75,5.75) 45(-2.25,5.75) 46(-2.75,5.75) 47(-3.25,5.75) 48(-3.75,5.75)
  oval 2x0.3 smd: 17(5.75,-3.75) 18(5.75,-3.25) 19(5.75,-2.75) 20(5.75,-2.25) 21(5.75,-1.75) 22(5.75,-1.25) 23(5.75,-0.75) 24(5.75,-0.25) 25(5.75,0.25) 26(5.75,0.75) 27(5.75,1.25) 28(5.75,1.75) 29(5.75,2.25) 30(5.75,2.75) 31(5.75,3.25) 32(5.75,3.75) 49(-5.75,3.75) 50(-5.75,3.25) 51(-5.75,2.75) 52(-5.75,2.25) 53(-5.75,1.75) 54(-5.75,1.25) 55(-5.75,0.75) 56(-5.75,0.25) 57(-5.75,-0.25) 58(-5.75,-0.75) 59(-5.75,-1.25) 60(-5.75,-1.75) 61(-5.75,-2.25) 62(-5.75,-2.75) 63(-5.75,-3.25) 64(-5.75,-3.75)
M2螺丝
  round 2.8 hole 2.3: 1(0,0)
R0603
  rect 0.806x0.864 smd: 1(-0.753,0) 2(0.753,0)
SMA_L4.3-W2.6-LS5.2-RD
  rect 2x2 smd: 1(-2.2,0) 2(2.2,0)
SOIC-8_L5.3-W5.3-P1.27-LS8.0-BL
  oval 0.63x2.25 smd: 1(-1.905,-3.53) 2(-0.635,-3.53) 3(0.635,-3.53) 4(1.905,-3.53) 5(1.905,3.53) 6(0.635,3.53) 7(-0.635,3.53) 8(-1.905,3.53)
SOT-223_L6.7-W3.5-P2.30-BR
  rect 2.2x1.1 smd: 1(3.099,-2.3) 2(3.099,0) 3(3.099,2.3)
  rect 2.2x3.5 smd: 4(-3.099,0)
SW-SMD_L6.0-W3.3-LS8.0
  rect 1.9x1.5 smd: 1(-4,0) 2(4,0)
SW-TH_SS-12D01-GX
  round 1.524 hole 0.914: 1(-2.5,0) 2(0,0) 3(2.5,0)
USB-C-SMD_KH-TYPE-C-16P
  oval 1.2x2 hole 0.7x1.7: 1(-4.32,1.765) 2(4.32,1.765)
  rect 0.3x1.3 smd: A1(-3.35,2.415) A4(-2.55,2.415) A5(-1.25,2.415) A6(-0.25,2.415) A7(0.25,2.415) A8(1.25,2.415) A9(2.55,2.415) A12(3.35,2.415) B1(3.05,2.415) B4(2.25,2.415) B5(1.75,2.415) B6(0.75,2.415) B7(-0.75,2.415) B8(-1.75,2.415) B9(-2.25,2.415) B12(-3.05,2.415)
USIP-8_L3.0-W2.8-P0.65-BL-EP
  rect 0.8x0.4 smd: 1(1.351,-0.975) 2(1.351,-0.325) 3(1.351,0.325) 4(1.351,0.975) 5(-1.351,0.975) 6(-1.351,0.325) 7(-1.351,-0.325) 8(-1.351,-0.975)
  rect 1.1x1.9 smd: 9(0,0)

## Nets
3.3V: BMP390.1 BMP390.5 BMP390.6 BMP390.10 C17.2 C18.2 C19.2 C100.2 C101.2 C102.2 C103.2 C104.2 CN6.4 CN7.4 CN8.4 H1.1 ICM42688.5 ICM42688.8 R1.2 R9.1 R14.1 R15.2 R121.2 R122.2 U8.13 U8.19 U8.32 U8.48 U8.64 U12.8 U53.2
5V: C91.2 C92.1 H2.4 U48.3 USB3.A4 USB3.A9 USB3.B4 USB3.B9
GND: 8M.2 8M.4 BMP390.3 BMP390.8 BMP390.9 C3.1 C4.1 C7.1 C14.1 C15.1 C16.1 C17.1 C18.1 C19.1 C91.1 C92.2 C93.1 C94.1 C100.1 C101.1 C102.1 C103.1 C104.1 C105.1 C106.1 C107.1 C108.1 CN1.1 CN6.3 CN7.3 CN8.3 H1.4 H2.3 ICM42688.6 ICM42688.7 ICM42688.11 LED3.2 Q13.1 Q13.2 Q13.3 Q14.1 Q14.2 Q14.3 Q15.1 Q15.2 Q15.3 Q16.1 Q16.2 Q16.3 R112.1 R113.1 R118.1 R119.2 R124.1 R125.1 R130.1 R133.1 R135.1 R137.1 SCREW1.1 SCREW2.1 SCREW3.1 SCREW4.1 SW1.1 U8.12 U8.18 U8.63 U12.4 U48.1 U52.5 U52.6 U52.9 USB3.1 USB3.2 USB3.A1 USB3.A12 USB3.B1 USB3.B12
VIN_3.3: C93.2 C94.2 C106.2 R123.2 U48.2 U48.4 U52.8 U53.1
B_ADC_IN: R129.1 R130.2 U8.11
BMP_INT: BMP390.7 U8.57
BMP_SCL: BMP390.2 R121.1 U8.58
BMP_SDA: BMP390.4 R122.1 U8.59
BOOT0: R119.1 U8.60
DN: U8.44 USB3.A7 USB3.B7
DP: U8.45 USB3.A6 USB3.B6
IMU_CS: ICM42688.12 U8.20
IMU_INT1: ICM42688.4 U8.39
IMU_INT2: ICM42688.9 U8.40
IMU_MISO: ICM42688.1 U8.22
IMU_MOSI: ICM42688.14 U8.23
IMU_SCLK: ICM42688.13 U8.21
MOTOR_PWM1: Q13.4 R125.2 U8.16
MOTOR_PWM2: Q14.4 R133.2 U8.27
MOTOR_PWM3: Q15.4 R135.2 U8.50
MOTOR_PWM4: Q16.4 R137.2 U8.62
PA8: U8.41
PA9: H2.1 U8.42
PA10: H2.2 U8.43
PA13: H1.3 U8.46
PA14: H1.2 U8.49
PB0: U8.26
PB2: R118.2 U8.28
PB3: U8.55
PB4: U8.56
PB8: U8.61
PB10: CN6.2 U8.29
PB11: CN6.1 U8.30
PB12: U8.33 U12.1
PB13: U8.34 U12.6
PB14: U8.35 U12.2
PB15: U8.36 U12.5
PC0: LED4.1 LED5.1 LED6.1 LED7.1 U8.8
PC1: U8.9
PC2: U8.10
PC4: U8.24
PC5: U8.25
PC6: CN7.1 U8.37
PC7: CN7.2 U8.38
PC10: CN8.1 U8.51
PC11: CN8.2 U8.52
PC12: U8.53
PC13: U8.2
PC14: 32.768K.1 C107.2 U8.3
PC15: 32.768K.2 C108.2 U8.4
PD2: U8.54
PH0: 8M.3 C4.2 R120.1 U8.5
PH1: 8M.1 C3.2 R120.2 U8.6
REST: C7.2 R1.1 SW1.2 U8.7
VBIN: C105.2 CN1.2 CN2.1 CN3.2 CN4.1 CN5.2 D1.1 D6.1 D7.1 D8.1 R129.2 R131.2 R132.2 R134.2 R136.2 U52.1 U52.3 U52.4
VCAP1: C14.2 U8.31
VCAP2: C15.2 U8.47
$3N397: U8.15
$3N2923: C16.2 U8.1
$3N3608: LED3.1 R9.2
$3N6562: R14.2 U12.7
$3N6651: R15.1 U12.3
$3N7026: R113.2 USB3.B5
$3N20479: R112.2 USB3.A5
$3N28799: R123.1 R124.2 U52.7
$3N34432: LED4.2 R131.1
$3N39293: CN2.2 D1.2 Q13.5
$3N40714: LED5.2 R132.1
$3N40717: CN3.1 D6.2 Q14.5
$3N40954: LED6.2 R134.1
$3N40957: CN4.2 D7.2 Q15.5
$3N41194: LED7.2 R136.1
$3N41197: CN5.1 D8.2 Q16.5

Pads without a net: CN1 3 4; CN2 3 4; CN3 3 4; CN4 3 4; CN5 3 4; CN6 5 6; CN7 5 6; CN8 5 6; ICM42688 2 3 10; U8 14 17; U52 2; U53 3; USB3 A8 B8

## Via types
v1: diameter 0.61, hole 0.305, Top Layer to Bottom Layer, 142 vias

## Routing (per net, layer and track width the routed paths; a pad name or vN(x,y) marks a point on that pad's centre or on a via; arc(x,y) is an arc through that point)
3.3V: length 196.5
  Top Layer w0.254: R1.2 35.95,24.77 33.68,22.5 U53.2 ; 36.51,5.91 36.79,6.19 36.89,6.19 37.41,6.71 37.41,7.74 37.35,7.8 37.35,16.13 U53.2 ; 36.51,5.91 R121.2 ; 36.51,5.91 36.2,6.22 BMP390.1 ; U12.8 16.57,7.74 15.75,7.74 15.57,7.56 15.57,3.81 15.75,3.63 19.99,3.63 22.1,1.52 26.16,1.52 30.36,5.72 R122.2 31.87,5.72 32.51,5.08 34.11,5.08 34.46,5.43 34.46,5.62 BMP390.10 ; U12.8 17.26,8.43 R14.1 ; U12.8 15.11,8.38 13.84,7.11 13.84,3.8 R15.2 ; BMP390.10 34.74,5.49 C103.2 ; BMP390.10 34.82,5.97 BMP390.1 ; C104.2 33.54,8.94 BMP390.5 33.26,6.97 BMP390.6 33.79,6.72 34.29,6.22 BMP390.1 ; ICM42688.5 23.22,17.82 C102.2 ; ICM42688.8 30.24,21.75 U53.2
  Top Layer w0.3: 21.47,36.98 21.47,35.69 21.46,35.68 ; 21.47,36.98 U8.13 ; 21.47,36.98 21.46,36.99 ; 21.47,36.98 21.99,36.47 arc(22.05,36.4) 22.12,36.33 22.46,36 27.17,36 27.63,36.45 U8.64 ; 21.46,35.68 21.23,35.45 ; 21.46,35.68 21.46,35.62 ; 21.46,35.68 21.46,38.35 ; 21.23,35.45 20.99,35.21 20.99,34.54 arc(21.02,34.37) 20.99,34.21 20.99,31.01 19.23,29.25 arc(19.14,29.13) 19.03,29.04 18.73,28.75 C19.2 C18.2 18.73,17.96 19.3,17.39 20.26,17.39 C101.2 C102.2 C100.2 27.76,17.46 R9.1 27.81,19.33 30.24,21.75 ; 21.23,35.45 U8.19 ; U53.2 27.47,26.02 U8.48
  Bottom Layer w0.5: CN6.4 8.64,24.75 10.54,26.65 15.48,26.65 19.63,22.5 U53.2 ; U53.2 25.97,27.52 CN8.4 26.01,34.76 26.01,40.89 H1.1 ; U53.2 33.24,20.25 CN7.4
5V: length 20.5
  Top Layer w0.254: USB3.A4 21.17,6.2 21.61,5.76 21.61,5.12 21.42,4.93 21.42,4.46 21.58,4.3 25.61,4.3 25.77,4.46 25.77,5.15 25.84,5.22 25.84,5.76 25.97,5.9 USB3.B4
  Bottom Layer w0.254: C91.2 28.92,5.13 28.92,6.74 28.41,7.25 26.8,7.25 26.46,7.6 U48.3
  Bottom Layer w0.5: H2.4 27.53,10.4 C92.1 27.16,8.74 26.05,7.62
  Bottom Layer w1: U48.3 26.05,7.62
  vias: v1(26.19,7.77)
GND: length 14.9
  Top Layer w0.254: R130.1 13.72,25 CN1.1
  Bottom Layer w0.3: CN6.3 10.14,23.25 arc(10.29,23.28) v1(10.41,23.36)
  Bottom Layer w0.5: H1.4 24.47,38.36 CN8.3
  vias: v1(9.02,1.66) v1(13.23,3.98) v1(14.73,5.88) v1(14.73,3.93) v1(15.25,43.43) v1(15.25,42.54) v1(15.32,39.53) v1(16.51,43.43) v1(16.53,42.54) v1(16.76,2.53) v1(17.34,37.15) v1(17.32,1.77) v1(17.45,43.43) v1(17.45,42.54) v1(17.53,39.13) v1(17.91,9.27) v1(18.16,37.21) v1(18.16,1.77) v1(18.29,11.93) v1(18.54,43.43) v1(18.54,42.54) v1(19.56,32) v1(19.56,30.47) v1(20.19,31.24) v1(20.57,1.52) v1(21.08,20.95) v1(22.23,3.68) v1(22.35,19.93) v1(22.48,36.83) v1(24.08,11.44) v1(24.64,19.68) v1(24.64,18.66) v1(24.89,28.44) v1(24.89,23.36) v1(24.98,11.44) v1(25.02,3.68) v1(25.65,20.7) v1(25.65,19.68) v1(25.65,18.66) v1(25.86,11.44) v1(26.46,24.75) v1(26.46,23.49) v1(26.67,20.7) v1(26.67,19.7) v1(26.67,18.7) v1(26.69,32.38) v1(26.69,31.36) v1(27.49,23.49) v1(27.69,32.38) v1(27.69,31.36) v1(28.45,23.49) v1(28.58,27.17) v1(29.08,26.67) v1(29.49,42.67) v1(29.72,26.03) v1(29.76,8) v1(29.75,6.98) v1(30.4,42.67) v1(30.79,35.94) v1(30.95,4.06) v1(30.95,3.04) v1(30.95,2.03) v1(31.37,42.67) v1(31.88,38.63) v1(32.26,4.06) v1(32.26,3.04) v1(32.26,2.03) v1(32.39,42.67) v1(32.64,5.82) v1(32.81,13.57) v1(32.81,12.7) v1(34.95,21.75) v1(35.75,21.75) v1(35.69,8.5) v1(37.46,25.78) v1(37.59,42.29) v1(37.6,35.62) v1(38.59,1.64)
VIN_3.3: length 61.3
  Top Layer w0.254: R123.2 15.49,13.21 13.57,11.3
  Top Layer w0.5: R123.2 14.04,15.15 U52.8 ; 29.05,8.72 29.05,5.08 27.39,3.42 25.78,3.42 24.85,2.49 ; v1(22.23,2.41) v1(23.07,2.41) v1(23.99,2.41) v1(24.85,2.41)
  Top Layer w0.6: 24.85,2.49 v1(24.85,2.41) ; 30.86,14.25 30.99,14.13 30.99,10.66 29.05,8.72 ; 30.86,14.25 18.83,14.25 17.65,13.08 16.12,13.08 R123.2 ; 30.86,14.25 30.99,14.38 U53.1
  Bottom Layer w0.254: C93.2 21.03,8.98 20.76,8.98 18.52,6.74 18.52,5.13 C94.2
  Bottom Layer w0.5: U48.2 23.72,8.39 C93.2
  Bottom Layer w1: v1(23.99,2.41) 23.99,7.33 U48.2
B_ADC_IN: length 31.8
  Top Layer w0.2: 13.97,22.54 13.91,22.6 10.03,22.6 9.72,22.91 9.72,25.62 10.6,26.5 10.76,26.5 13.46,29.2 13.46,34.54 14.58,35.66 15,35.66 16.63,37.29 16.63,37.84 16.97,38.17 18.31,38.17 19.57,39.44 19.57,39.46 19.81,39.7 22.14,39.7 22.37,39.46 22.37,38.55 U8.11
  Top Layer w0.254: R130.2 R129.1
BMP_INT: length 35.2
  Top Layer w0.2: U8.57 30.39,32.95 30.58,33.14 31.04,33.14 31.96,32.21 31.96,32.14 v1(32.09,32.02)
  Top Layer w0.254: v1(35.18,12.19) 35.18,11.7 33.71,10.23 32.68,10.23 32.26,9.81 32.26,8.67 31.5,7.91 30.95,7.91 30.73,7.69 30.73,6.76 30.95,6.54 32.74,6.54 32.99,6.29 33.18,6.29 BMP390.7
  Inner1 w0.2: v1(35.18,12.19) 33.4,13.97 33.4,28.29 32.35,29.35 32.35,31.76 v1(32.09,32.02)
BMP_SCL: length 33.8
  Top Layer w0.2: v1(33.33,32.58) 32.02,32.58 31.15,33.45 U8.58
  Top Layer w0.254: v1(36.7,12.19) R121.1 36.2,6.72 BMP390.2
  Inner1 w0.2: v1(36.7,12.19) 36.7,12.21 35.87,13.05 35.18,13.05 35.16,13.06 ; v1(33.33,32.58) 32.96,32.21 32.96,29.59 34.01,28.54 34.01,14.22 35.16,13.06
BMP_SDA: length 36
  Top Layer w0.2: v1(32.4,33.13) 31.59,33.95 U8.59
  Top Layer w0.254: BMP390.4 34.04,9.68 33.85,9.87 ; 33.85,9.87 35.94,11.96 v1(35.94,12.19) ; 33.85,9.87 32.82,9.87 32.66,9.7 32.66,8.39 R122.1
  Inner1 w0.2: v1(32.4,33.13) 32.65,32.88 32.65,29.47 33.7,28.42 33.7,14.09 35.05,12.74 35.41,12.74 35.94,12.21 v1(35.94,12.19)
BOOT0: length 4.3
  Top Layer w0.254: R119.1 32.61,34.45 U8.60
DN: length 32.5
  Top Layer w0.2: USB3.A7 23.87,6.72 23.87,7.38 23.73,7.52 23.22,7.52 23.07,7.38 23.07,6.72 USB3.B7 22.97,5.97 22.46,5.46 v1(22.23,5.46) ; U8.44 25.37,26.85 25.37,25.93 25.08,25.63 25.08,25.44 24.72,25.09 20.73,25.09 19.99,24.36 19.99,19.74 20.37,19.35 20.73,19.35 21.3,18.79 v1(21.34,18.79)
  Inner1 w0.2: v1(21.34,18.79) 21.34,15.36 22.9,13.8 22.91,13.8 23.55,13.15 23.55,12.24 22.23,10.91 v1(22.23,5.46)
DP: length 34.3
  Top Layer w0.2: U8.45 25.87,26.85 25.87,25.81 24.85,24.79 20.85,24.79 20.29,24.23 20.29,19.86 20.5,19.66 21.26,19.66 22.12,18.8 v1(22.12,18.79) ; USB3.B6 24.37,6.52 24.37,5.87 24.23,5.72 23.72,5.72 23.57,5.87 23.57,6.52 USB3.A6 23.47,5.49 v1(22.86,4.88)
  Inner1 w0.2: v1(22.86,4.88) 22.78,4.96 22.78,5.69 22.53,5.94 22.53,10.79 23.86,12.11 23.86,13.28 23.03,14.1 23.03,14.1 21.64,15.49 21.64,18.31 22.12,18.79 v1(22.12,18.79)
IMU_CS: length 15.1
  Top Layer w0.2: v1(24.18,24.23) 24.18,24.04 24.22,24 ICM42688.12 ; U8.20 19.31,34.95 arc(19.58,35) 19.84,34.93 arc(19.88,34.9) 19.92,34.88 arc(20.19,34.65) v1(20.41,34.37)
  Inner1 w0.2: v1(24.18,24.23) 24.18,25.05 22.42,26.81 22.42,32.37 v1(20.41,34.37)
IMU_INT1: length 15.5
  Top Layer w0.2: U8.39 v1(22.97,28.7) ; v1(22.46,21.08) 22.46,21.08 ICM42688.4
  Inner1 w0.2: v1(22.97,28.7) 23.19,28.92 23.19,28.93 23.52,29.25 23.98,29.25 24.31,28.93 24.31,28.47 23.8,27.96 23.8,26.28 25.52,24.56 25.52,21.83 24.77,21.08 v1(22.46,21.08)
IMU_INT2: length 9.9
  Top Layer w0.2: U8.40 23.49,26.97 23.49,28.44 v1(23.75,28.7) ; ICM42688.9 25.43,22.25 25.67,22.49 25.67,23.51 v1(24.95,24.23)
  Inner1 w0.2: v1(24.95,24.23) 24.95,24.7 23.49,26.16 23.49,28.43 23.75,28.69 v1(23.75,28.7)
IMU_MISO: length 14
  Top Layer w0.2: v1(19.56,33.65) 19.26,33.95 U8.22 ; ICM42688.1 22.37,23.34 22.17,23.34 21.39,24.12 v1(21.21,24.12)
  Inner1 w0.2: v1(19.56,33.65) 19.56,32.81 19.91,32.46 20.24,32.46 21.51,31.19 21.51,24.43 v1(21.21,24.12)
IMU_MOSI: length 13.5
  Top Layer w0.2: ICM42688.14 23.02,23.51 arc(22.93,23.61) 22.8,23.64 22.61,23.64 arc(22.21,23.82) v1(22.07,24.23) ; v1(20.14,33.02) 19.32,33.02 18.99,33.35 18.07,33.35 U8.23
  Inner1 w0.2: v1(22.07,24.23) 21.81,24.49 21.81,31.34 v1(20.14,33.02)
IMU_SCLK: length 14.8
  Top Layer w0.2: U8.21 v1(19.56,34.45) ; ICM42688.13 23.72,23.9 23.39,24.23 v1(22.83,24.23)
  Inner1 w0.2: v1(22.83,24.23) 22.63,24.44 22.63,24.46 22.11,24.97 22.11,31.47 20.7,32.89 20.7,33.3 19.68,34.31 19.44,34.31 19.43,34.32 v1(19.56,34.45)
MOTOR_PWM1: length 7.3
  Top Layer w0.2: U8.16 19.97,36.79 v1(20.07,36.7)
  Bottom Layer w0.2: Q13.4 17.15,36.19 19.56,36.19 v1(20.07,36.7)
  Bottom Layer w0.254: R125.2 16.99,35.41 Q13.4
MOTOR_PWM2: length 41.2
  Top Layer w0.2: U8.27 16.38,31.45 15.58,32.25 v1(15.58,32.34)
  Inner1 w0.254: v1(17.02,26.54) 17.02,24.62 14.65,22.26 14.65,13.1 14.43,12.87 14.43,11.32 15.72,10.03 15.72,2 v1(15.62,1.9)
  Bottom Layer w0.2: v1(15.58,32.34) 15.58,27.97 v1(17.02,26.54)
  Bottom Layer w0.254: v1(15.62,1.9) 15.74,2.02 R133.2 16.99,6.45 Q14.4
MOTOR_PWM3: length 25.7
  Top Layer w0.2: v1(31.79,30.11) 31.53,29.86 31.3,29.86 30.89,29.45 U8.50
  Inner1 w0.254: v1(31.8,10.67) 32.03,10.9 32.03,25.62 30.73,26.92 v1(30.48,26.92)
  Bottom Layer w0.2: v1(30.48,26.92) 31.79,28.23 v1(31.79,30.11)
  Bottom Layer w0.254: Q15.4 30.46,9.33 v1(31.8,10.67)
MOTOR_PWM4: length 8.3
  Top Layer w0.2: v1(27.43,35.43) 29.45,35.43 U8.62
  Bottom Layer w0.2: Q16.4 29.98,37.97 v1(27.43,35.43)
  Bottom Layer w0.254: R137.2 30.46,38.45 Q16.4
PA9: length 18.8
  Top Layer w0.2: v1(19.68,18.79) 19.39,19.09 19.39,24.61 20.48,25.69 24.33,25.69 24.47,25.84 U8.42
  Inner1 w0.2: v1(19.68,18.79) 19.68,12.92 H2.1
PA10: length 19.9
  Top Layer w0.2: U8.43 24.87,26.85 24.87,25.93 24.77,25.83 24.77,25.59 24.58,25.39 20.6,25.39 19.69,24.48 19.69,19.61 v1(20.5,18.8)
  Inner1 w0.2: v1(20.5,18.8) 20.5,14.65 H2.2
PA13: length 40.4
  Top Layer w0.254: 26.54,27.15 26.4,27.29 26.4,27.98 26.85,28.42 27.13,28.42 27.45,28.73 28.23,28.73 28.45,28.52 30.94,28.52 31.59,29.17 33.88,29.17 38.48,33.78 38.48,34.43 38.77,34.73 38.77,38.68 38.48,38.97 38.48,39.51 36.93,41.05 36.93,42.05 34.82,44.17 24.21,44.17 H1.3
PA14: length 32.2
  Top Layer w0.254: U8.49 29.5,28.98 30.89,28.98 31.4,29.49 31.4,29.49 31.44,29.53 33.73,29.53 38.12,33.92 38.12,34.58 38.42,34.88 38.42,38.52 38.12,38.81 38.12,39.36 36.58,40.91 36.58,41.91 34.67,43.81 26.39,43.81 H1.2
PB2: length 4.6
  Top Layer w0.254: R118.2 16.16,30.95 U8.28
PB10: length 18.6
  Top Layer w0.2: U8.29 16.68,30.45 16.51,30.62 16.02,30.62 15.89,30.75 v1(15.03,30.75)
  Inner1 w0.2: v1(5.84,21.71) 5.84,22.22 14.37,30.75 v1(15.03,30.75)
  Bottom Layer w0.5: v1(5.84,21.71) 8.08,21.71 CN6.2
PB11: length 19.6
  Top Layer w0.2: U8.30 17.87,30.05 16.96,30.05 16.94,30.06 v1(16.26,30.06)
  Inner1 w0.2: v1(5.84,20.44) 5.84,21.04 arc(5.84,21.1) 5.85,21.16 arc(6.36,21.52) 6.21,22.13 arc(6.29,22.23) 6.37,22.32 14.18,30.13 16.18,30.13 v1(16.26,30.06)
  Bottom Layer w0.5: v1(5.84,20.44) 7.92,20.44 CN6.1
PB12: length 23.9
  Top Layer w0.2: v1(15.37,12.06) 14.53,11.22 14.53,10.65 12.26,8.38 U12.1
  Top Layer w0.254: v1(19.43,26.03) 19.97,26.57 U8.33
  Inner1 w0.254: v1(19.43,26.03) 15.37,21.97 v1(15.37,12.06)
PB13: length 33.9
  Top Layer w0.2: U12.6 17.91,5.13 18.25,5.13 18.82,4.57 v1(20.19,4.57)
  Top Layer w0.254: U8.34 20.47,27.53 20.4,27.6 20.4,27.98 20.15,28.23 19.8,28.23 19.54,27.98 19.54,27.1 v1(19.37,26.92)
  Inner1 w0.254: v1(19.37,26.92) 20.02,26.27 20.02,25.66 19.67,25.32 19.35,25.32 15.75,21.72 15.75,12.5 16.08,12.17 16.08,7.53 19.04,4.57 20.19,4.57
PB14: length 29.7
  Top Layer w0.2: v1(15.49,11.18) 11.42,7.11 U12.2
  Top Layer w0.254: v1(20.19,28.95) 20.97,28.17 U8.35
  Inner1 w0.254: v1(15.49,11.18) 15.42,11.18 14.78,11.82 14.78,12.72 15.01,12.95 15.01,22.11 18.1,25.2 18.1,26.86 v1(20.19,28.95)
PB15: length 38.9
  Top Layer w0.2: v1(20.95,3.97) 20.94,3.95 17.82,3.95 U12.5
  Top Layer w0.254: U8.36 21.47,28.81 v1(20.7,29.59)
  Inner1 w0.254: v1(20.95,3.97) 21.61,4.63 21.61,5.76 21.15,6.22 20.8,6.22 19.67,7.35 16.88,7.35 16.43,7.8 16.43,12.32 16.15,12.61 16.15,21.29 20.37,25.51 20.37,28.3 20.78,28.71 20.78,29.51 v1(20.7,29.59)
PC0: length 137.8
  Top Layer w0.254: LED6.1 38.49,0.5 9.02,0.5 7.87,1.65 arc(7.77,1.79) 7.74,1.96 7.74,2.83 arc(7.62,3.01) 7.44,3.13 arc(7.24,3.21) 7.16,3.41 7.16,4.22 arc(7.24,4.41) 7.44,4.5 7.67,4.5 arc(7.71,4.52) 7.74,4.57 arc(7.71,4.61) 7.67,4.64 7.44,4.64 arc(7.24,4.72) 7.16,4.92 7.16,5.72 arc(7.24,5.92) 7.44,6 7.59,6 arc(7.68,6.06) 7.74,6.15 7.74,12.39 arc(8.22,12.32) 8.71,12.39 arc(9.83,14.48) 7.74,15.61 7.74,29.39 arc(8.22,29.32) 8.71,29.39 arc(9.83,31.48) 7.74,32.61 7.74,39.21 arc(7.6,39.31) 7.54,39.48 7.54,40.28 arc(7.6,40.45) 7.74,40.55 7.74,40.72 arc(7.6,40.82) 7.54,40.98 7.54,41.79 arc(7.6,41.96) 7.74,42.06 LED4.1 8.75,44.57 38.61,44.57 LED7.1 39.95,43.23 39.95,41 39.79,40.83 v1(38.23,40.83) ; U8.8 23.97,37.18 v1(23.62,36.83)
  Inner1 w0.254: v1(38.23,40.83) 34.22,36.83 v1(23.62,36.83)
PC6: length 17.5
  Top Layer w0.2: v1(27.94,29.49) 27.87,29.56 24.36,29.56 24.16,29.76 22.57,29.76 21.94,29.14 21.94,26.98 U8.37
  Inner1 w0.254: v1(27.94,29.49) 30.07,29.49 v1(32.77,26.79)
  Bottom Layer w0.254: CN7.1 32.91,26.79 v1(32.77,26.79)
PC7: length 18.1
  Top Layer w0.2: v1(26.89,29) 24.47,29 24.02,29.46 22.82,29.46 22.42,29.05 22.42,27.33 22.47,27.27 U8.38
  Inner1 w0.254: v1(26.89,29) 26.99,28.91 29.64,28.91 v1(32,26.54)
  Bottom Layer w0.254: CN7.2 34.2,24 33.27,24 33.09,24.18 33.09,25.45 v1(32,26.54)
PC10: length 11
  Top Layer w0.2: v1(24.88,30.84) 25.01,30.84 25.8,30.05 29.37,30.05 U8.51
  Bottom Layer w0.2: CN8.1 21.47,33 22.1,32.38 23.34,32.38 v1(24.88,30.84)
PC11: length 9.2
  Top Layer w0.2: U8.52 26.06,30.45 v1(24.89,31.62)
  Bottom Layer w0.2: CN8.2 22.97,33.16 23.38,32.75 23.76,32.75 v1(24.89,31.62)
PC14: length 15.3
  Top Layer w0.254: 33.15,38.08 33.51,37.71 34.14,37.71 35.43,39 35.43,39.13 33.52,41.04 26.67,41.04 26.49,40.86 26.49,38.47 U8.3
PC15: length 16.7
  Top Layer w0.254: 37.72,38.08 37.72,39.22 35.43,41.5 35.33,41.4 26.29,41.4 25.91,41.02 25.91,38.51 U8.4
PH0: length 17.3
  Top Layer w0.254: R120.1 14.34,40.25 8M.3 15.43,41.13 C4.2 17.65,41 24.78,41 25.47,40.31 U8.5
PH1: length 23.1
  Top Layer w0.254: U8.6 24.97,40.3 24.63,40.64 18.95,40.64 18.42,40.11 16.74,40.11 16.3,39.68 16.3,37.43 14.86,35.99 13.82,35.99 13.11,36.7 R120.2 13.12,36.99 8M.1 12.72,39.13 C3.2
REST: length 28
  Top Layer w0.2: U8.7 24.51,38.41 24.51,37.08 24.74,36.85 32.17,36.85 32.37,36.66 33.93,36.66 36.07,34.51 v1(36.07,32.89)
  Top Layer w0.254: v1(37.46,27.81) 38.04,27.81 SW1.2 39.24,26.14 C7.2
  Inner1 w0.2: v1(36.07,32.89) 37.46,31.5 v1(37.46,27.81)
VBIN: length 7.6
  Top Layer w0.254: 15.49,17.76 15.4,17.86 U52.1 ; 11.92,20 13.77,20 R129.2
  Top Layer w0.5: U52.1 13.55,18.33 13.5,18.38 13.5,18.42 11.92,20 CN1.2
  vias: v1(7.87,5.37) v1(8.26,39.84) v1(39.12,5.24) v1(39.24,39.96)
VCAP1: length 4.2
  Top Layer w0.254: C14.2 15.19,29.45 U8.31
VCAP2: length 6
  Top Layer w0.15: C15.2 31.45,28.17 27.32,28.17 27.1,27.95 27.1,27.07 U8.47
$3N2923: length 2.2
  Top Layer w0.254: C16.2 29.53,38.48 29.5,38.45 U8.1
$3N3608: length 2.2
  Top Layer w0.254: LED3.1 29.67,16.01 R9.2
$3N6562: length 7.2
  Top Layer w0.254: R14.2 16.03,10.16 16.74,10.87 17.78,10.87 18.61,10.04 18.61,8.13 18.26,7.78 17.88,7.78 U12.7
$3N6651: length 4.9
  Top Layer w0.254: R15.1 11.94,4.19 11.94,4.95 11.05,5.84 U12.3
$3N7026: length 2.6
  Top Layer w0.254: R113.2 25.47,8.06 USB3.B5
$3N20479: length 2.8
  Top Layer w0.254: R112.2 22.47,7.49 USB3.A5
$3N28799: length 2.8
  Top Layer w0.254: R123.1 R124.2 12.9,13.92 12.9,15.15
$3N34432: length 2.9
  Top Layer w0.254: R131.1 8.26,41.88 LED4.2
$3N40714: length 3.1
  Top Layer w0.254: R132.1 10.04,1.65 10.07,1.65
$3N40954: length 2.7
  Top Layer w0.254: LED6.2 39.12,3.33 R134.1
$3N41194: length 2.8
  Top Layer w0.254: LED7.2 39.24,41.74 R136.1

## Copper pours and planes (outline as drawn; the poured copper is in the pictures)
5V on Top Layer: 25.67,8.22 26.54,8.22 26.54,5.84 25.67,5.84
GND on Top Layer: -0.51,45.33 41.91,45.33 41.91,-0.51 -0.51,-0.51
GND on Bottom Layer: -0.89,45.21 41.53,45.21 41.53,-0.77 -0.89,-0.77
GND on Inner2: 0.26,44.74 40.97,44.74 40.97,0.26 0.26,0.26
VBIN on Top Layer: 9.65,21.23 12.57,21.23 12.57,17.45 9.65,17.45
VBIN on Bottom Layer: 33.41,4.32 33.41,40.45 41.22,40.45 41.22,4.32
VBIN on Bottom Layer: 36.42,18.09 9.78,18.09 9.78,14.47 9.65,14.35 36.45,14.35 36.45,18.06
VBIN on Bottom Layer: 12.96,40.56 12.96,4.33 6.24,4.33 6.24,15.47 6.22,15.49 0,15.49 0,29.46 6.22,29.46 6.22,40.56 6.23,40.56
VBIN on Bottom Layer: 12.95,21.46 12.95,4.32 6.09,4.32 6.09,15.75 5.97,15.87 9.66,15.87 9.66,21.46
$3N39293 on Bottom Layer: 10.73,40.58 10.73,33.95 13.33,33.95 13.33,35.56 16.38,35.56 16.38,38.48 12.95,38.48 12.95,40.58 12.95,40.58
$3N40717 on Bottom Layer: 10.67,4.57 10.67,11.05 13.32,11.05 13.32,9.52 16.26,9.52 16.26,6.57 12.95,6.57 12.95,4.57
$3N40957 on Bottom Layer: 36.83,11.17 36.83,4.27 34.28,4.27 34.28,6.47 31.1,6.47 31.1,9.37 31.11,9.39 34.16,9.39 34.16,11.17
$3N41197 on Bottom Layer: 36.84,40.51 36.84,33.78 34.16,33.78 34.16,35.56 31.11,35.56 31.11,38.6 34.16,38.6 34.16,40.51

Small or netless copper shapes (teardrops, artwork), in the pictures only: 1 on Top Layer

## Text on the board
Bottom Silkscreen Layer: 3.3 | T | R | G | + | 光流 | lora | GPS
Top Silkscreen Layer: GND | DIO | CLK | 3.3 | FLASH | TX | RX | G | 5V | PWR | 1S3.7V | RST | by_aBo | OFF | ON | + | - | X→ | Y→
